# EAGLE design ESP-WROOM-02-ASIF-12 (EAGLE 6.6.0)
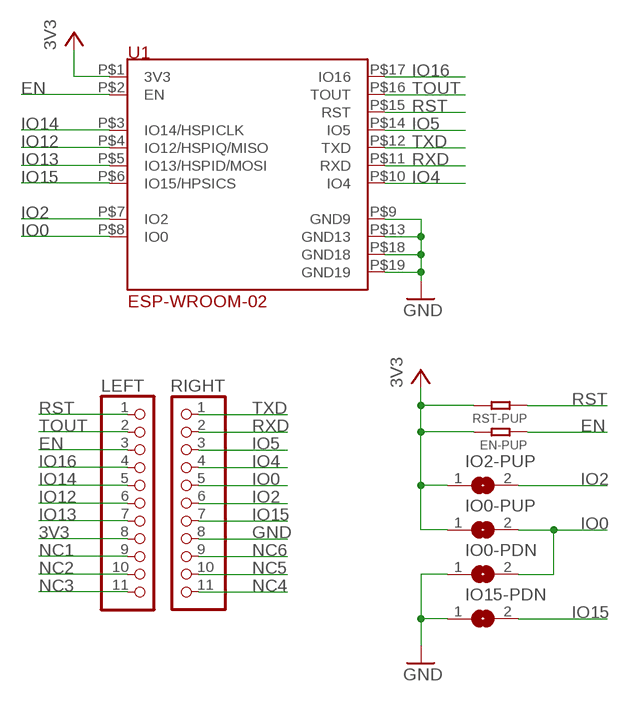
[diagram p0: schematic, sheet 1]

## Parts
EN-PUP  10K  SMD-RES-10K-1%-1/8W(0805)  [R0805]
IO0-PDN  SJ  [SJ]
IO0-PUP  SJ  [SJ]
IO2-PUP  SJ  [SJ]
IO15-PDN  SJ  [SJ]
LEFT  PINHD-1X11OCT  [1X11OCT]
RIGHT  PINHD-1X11OCT  [1X11OCT]
RST-PUP  10K  SMD-RES-10K-1%-1/8W(0805)  [R0805]
U1  ESP-WROOM-02  [ESP-WROOM-02]

## Nets
3V3: EN-PUP.2 IO0-PUP.1 IO2-PUP.1 LEFT.8 RST-PUP.2 U1.P$1(3V3)
EN: EN-PUP.1 LEFT.3 U1.P$2(EN)
GND: IO0-PDN.1 IO15-PDN.1 RIGHT.8 U1.P$9(GND9) U1.P$13(GND13) U1.P$18(GND18) U1.P$19(GND19)
IO0: IO0-PDN.2 IO0-PUP.2 RIGHT.5 U1.P$8(IO0)
IO2: IO2-PUP.2 RIGHT.6 U1.P$7(IO2)
IO4: RIGHT.4 U1.P$10(IO4)
IO5: RIGHT.3 U1.P$14(IO5)
IO12: LEFT.6 U1.P$4(IO12/HSPIQ/MISO)
IO13: LEFT.7 U1.P$5(IO13/HSPID/MOSI)
IO14: LEFT.5 U1.P$3(IO14/HSPICLK)
IO15: IO15-PDN.2 RIGHT.7 U1.P$6(IO15/HPSICS)
IO16: LEFT.4 U1.P$17(IO16)
NC1: LEFT.9
NC2: LEFT.10
NC3: LEFT.11
NC4: RIGHT.11
NC5: RIGHT.10
NC6: RIGHT.9
RST: LEFT.1 RST-PUP.1 U1.P$15(RST)
RXD: RIGHT.2 U1.P$11(RXD)
TOUT: LEFT.2 U1.P$16(TOUT)
TXD: RIGHT.1 U1.P$12(TXD)

## Library data of the parts
EN-PUP RST-PUP = Seeed-Resistor:SMD-RES-10K-1%-1/8W(0805): 301010361; MPN: RC0805FR-0710KL
IO0-PDN IO0-PUP IO2-PUP IO15-PDN = jumper:SJ: SMD solder JUMPER
LEFT RIGHT = pinhead:PINHD-1X11: PIN HEADER
U1 = PCR-Module:ESP-WROOM-02

## Board
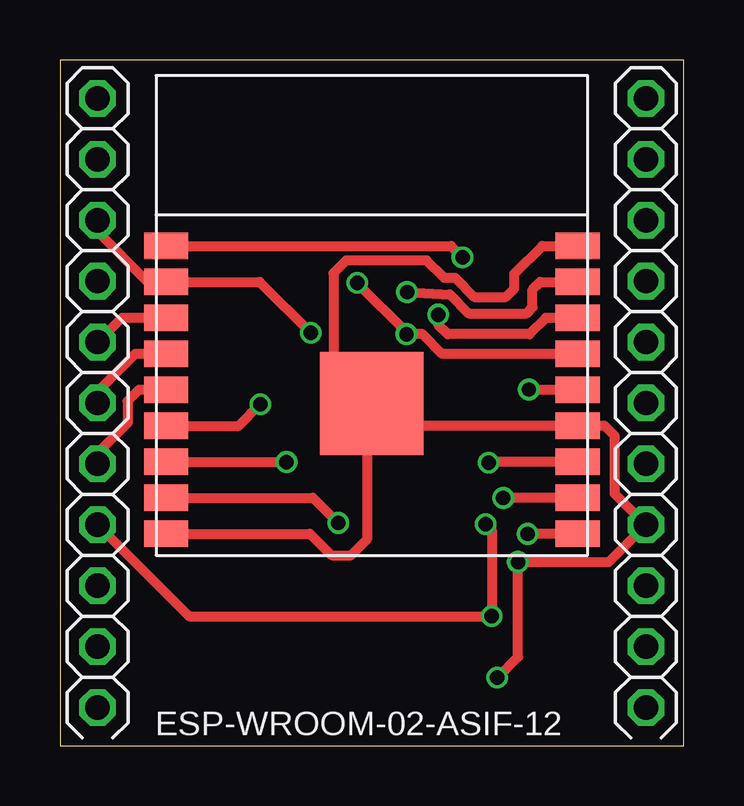
[diagram p1: board, top side]
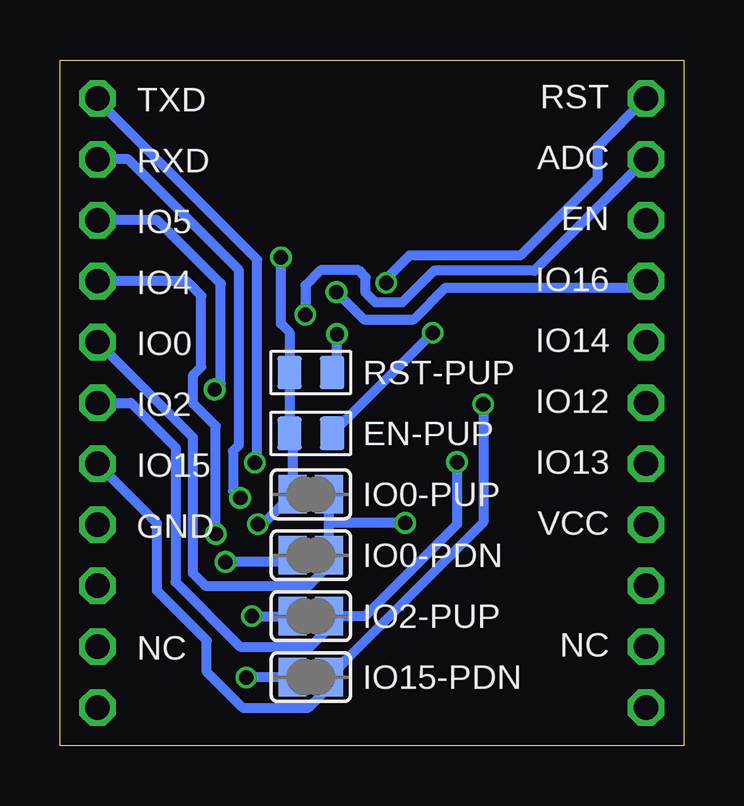
[diagram p2: board, bottom side, seen from below]

Size 26 x 28.6 mm. Coordinates in mm from the lower left corner, seen from the top.
Outline: 0,0 26,0 26,28.6 0,28.6 0,0
Copper layers (1*16): Top 0.035mm / dielectric 1.5mm / Bottom 0.035mm
Design rules "Fusion_eagle_rule_v1.1": minimum track width 6mil, minimum drill 12mil, track to track 6mil, track to pad 6mil, pad to pad 6mil, via to via 6mil, smd to smd 0mil, copper to edge 10mil, drill to drill 10mil, minimum pad ring 10mil, minimum via ring 6mil, stop-mask expansion 2mil, vias tented up to drill 100mil, thermal gap 10mil

### Footprints (pad centres in the part's own frame; a part is rotated, then mirrored left to right if it is on the bottom)
R0805 = smd 1.397 x 1.016: 1 0,0.889; 2 0,-0.889
SJ = smd 1.168 x 1.6: 1 -0.762,0; 2 0.762,0
1X11OCT = drill 1.016 octagon: 1 -12.7,0; 2 -10.16,0; 3 -7.62,0; 4 -5.08,0; 5 -2.54,0; 6 0,0; 7 2.54,0; 8 5.08,0; 9 7.62,0; 10 10.16,0; 11 12.7,0
ESP-WROOM-02 = smd 1.85 x 1.1: P$1 -8.575,12.9; P$2 -8.575,11.4; P$3 -8.575,9.9; P$4 -8.575,8.4; P$5 -8.575,6.9; P$6 -8.575,5.4; P$7 -8.575,3.9; P$8 -8.575,2.4; P$9 -8.575,0.9; P$10 8.575,0.9; P$11 8.575,2.4; P$12 8.575,3.9; P$13 8.575,5.4; P$14 8.575,6.9; P$15 8.575,8.4; P$16 8.575,9.9; P$17 8.575,11.4; P$18 8.575,12.9 | smd 4.3 x 4.3: P$19 0,6.33

### Placement (x,y rotation side)
EN-PUP  15.54,13.03 270 bottom
IO0-PDN  15.54,7.95 0 bottom
IO0-PUP  15.54,10.49 0 bottom
IO2-PUP  15.54,5.41 0 bottom
IO15-PDN  15.54,2.87 0 bottom
LEFT  1.57,14.3 270 top
RIGHT  24.43,14.3 270 top
RST-PUP  15.54,15.57 270 bottom
U1  13,7.95 0 top

### Tracks (layer width: path | path; a pad name or v marks a point on that pad's centre or on a via)
3V3  (via drill 0.6)
  Top 0.406: U1.P$1 16.3,20.85 v16.79,20.37 | LEFT.8 5.38,5.41 v18,5.41 18,8.99 v17.75,9.25
  Bottom 0.406: v16.79,20.37 16.79,17.6 16.43,17.25 RST-PUP.2 EN-PUP.2 16.3,12.9 IO0-PUP.1 17.55,9.25 v17.75,9.25 | v18,5.41 IO2-PUP.1
EN  (via drill 0.6)
  Top 0.406: LEFT.3 1.57,21.44 3.66,19.35 U1.P$2 8.33,19.35 v10.46,17.22
  Bottom 0.406: v10.46,17.22 EN-PUP.1
GND  (via drill 0.6)
  Top 0.406: U1.P$19 13,13.35 U1.P$13 22.71,13.35 23.13,12.93 23.13,10.52 RIGHT.8 22.88,7.67 v19.1,7.67 19.1,3.71 v18.23,2.85 | U1.P$19 11.4,15.88 11.4,19.71 11.93,20.24 15.29,20.24 16.02,19.51 16.48,19.51 17.27,18.72 18.59,18.72 18.94,19.08 18.94,19.69 20.11,20.85 U1.P$18 | U1.P$9 10.42,8.85 11.32,7.95 12.14,7.95 12.82,8.64 12.82,14.1 U1.P$19
  Bottom 0.406: IO0-PDN.1 16.58,7.67 v19.1,7.67 | IO15-PDN.1 18.21,2.87 v18.23,2.85
IO0  (via drill 0.6)
  Top 0.406: U1.P$8 10.55,10.35 v11.6,9.3
  Bottom 0.406: 14.78,9.14 IO0-PDN.2 14.78,7.54 15.64,6.68 19.93,6.68 20.47,7.21 20.47,12.88 RIGHT.5 | 14.78,9.14 IO0-PUP.2 | v11.6,9.3 14.63,9.3 14.78,9.14
IO2  (via drill 0.6)
  Top 0.406: U1.P$7 v9.43,11.85 v9.44,11.84
  Bottom 0.406: RIGHT.6 23.03,14.3 21.18,12.45 21.18,6.83 18.49,4.14 15.56,4.14 14.78,4.93 IO2-PUP.2 13.28,5.41 9.44,9.25 v9.44,11.84
IO4  (via drill 0.6)
  Top 0.406: U1.P$10 21.56,8.84 v19.5,8.84
  Bottom 0.406: RIGHT.4 20.72,19.38 20.11,18.77 20.11,15.8 20.44,15.47 20.44,14.28 19.5,13.34 v19.5,8.84
IO5  (via drill 0.6)
  Top 0.406: U1.P$14 19.56,14.85 v19.55,14.86
  Bottom 0.406: v19.55,14.86 19.3,15.11 19.3,19.28 21.94,21.92 RIGHT.3
IO12
  Top 0.406: U1.P$4 3.14,16.35 1.57,14.78 LEFT.6
IO13
  Top 0.406: U1.P$5 3.29,14.85 2.81,14.38 2.81,13.46 1.57,12.22 LEFT.7
IO14
  Top 0.406: U1.P$3 2.58,17.85 LEFT.5
IO15  (via drill 0.6)
  Top 0.406: U1.P$6 7.45,13.35 v8.35,14.25
  Bottom 0.406: RIGHT.7 21.97,9.3 21.97,6.48 19.88,4.39 19.88,3.1 18.38,1.6 15.64,1.6 14.78,2.46 IO15-PDN.2 14.14,3.51 14.14,3.53 8.35,9.32 v8.35,14.25
IO16  (via drill 0.6)
  Top 0.406: v14.47,18.92 16.25,18.82 17.04,18.03 19.45,18.03 19.71,18.29 19.71,19.02 20.03,19.35 U1.P$17
  Bottom 0.406: v14.47,18.92 13.33,17.78 11.25,17.78 9.93,19.1 1.85,19.1 LEFT.4
RST  (via drill 0.6)
  Top 0.406: U1.P$15 15.93,16.35 15.11,17.17 v14.45,17.17 14.45,17.25 v12.39,19.3
  Bottom 0.406: LEFT.1 3.58,24.99 3.58,23.67 6.8,20.45 11.43,20.45 12.39,19.48 v12.39,19.3 | RST-PUP.1 14.45,15.77 v14.45,17.17
RXD  (via drill 0.6)
  Top 0.406: U1.P$11 21.56,10.34 v18.49,10.34
  Bottom 0.406: RIGHT.2 23.16,24.46 18.54,19.84 18.54,12.55 18.79,12.29 18.79,10.64 v18.49,10.34
TOUT  (via drill 0.6)
  Top 0.406: U1.P$16 20.26,17.85 19.58,17.17 16.18,17.17 15.77,17.58 v15.77,17.98
  Bottom 0.406: LEFT.2 6.22,19.81 10.41,19.81 11.73,18.49 12.85,18.49 13.25,18.9 13.25,19.53 13.56,19.84 15.13,19.84 15.77,19.2 v15.77,17.98
TXD  (via drill 0.6)
  Top 0.406: U1.P$12 17.92,11.85 v17.88,11.81
  Bottom 0.406: RIGHT.1 24.43,26.92 17.77,20.27 17.77,11.91 v17.88,11.81

### Text on the board
tPlace: ESP-WROOM-02-ASIF-12
bPlace: RST | TXD | ADC | RXD | EN | IO5 | IO16 | IO4 | IO14 | IO0 | IO12 | IO2 | IO13 | IO15 | VCC | GND | NC | NC